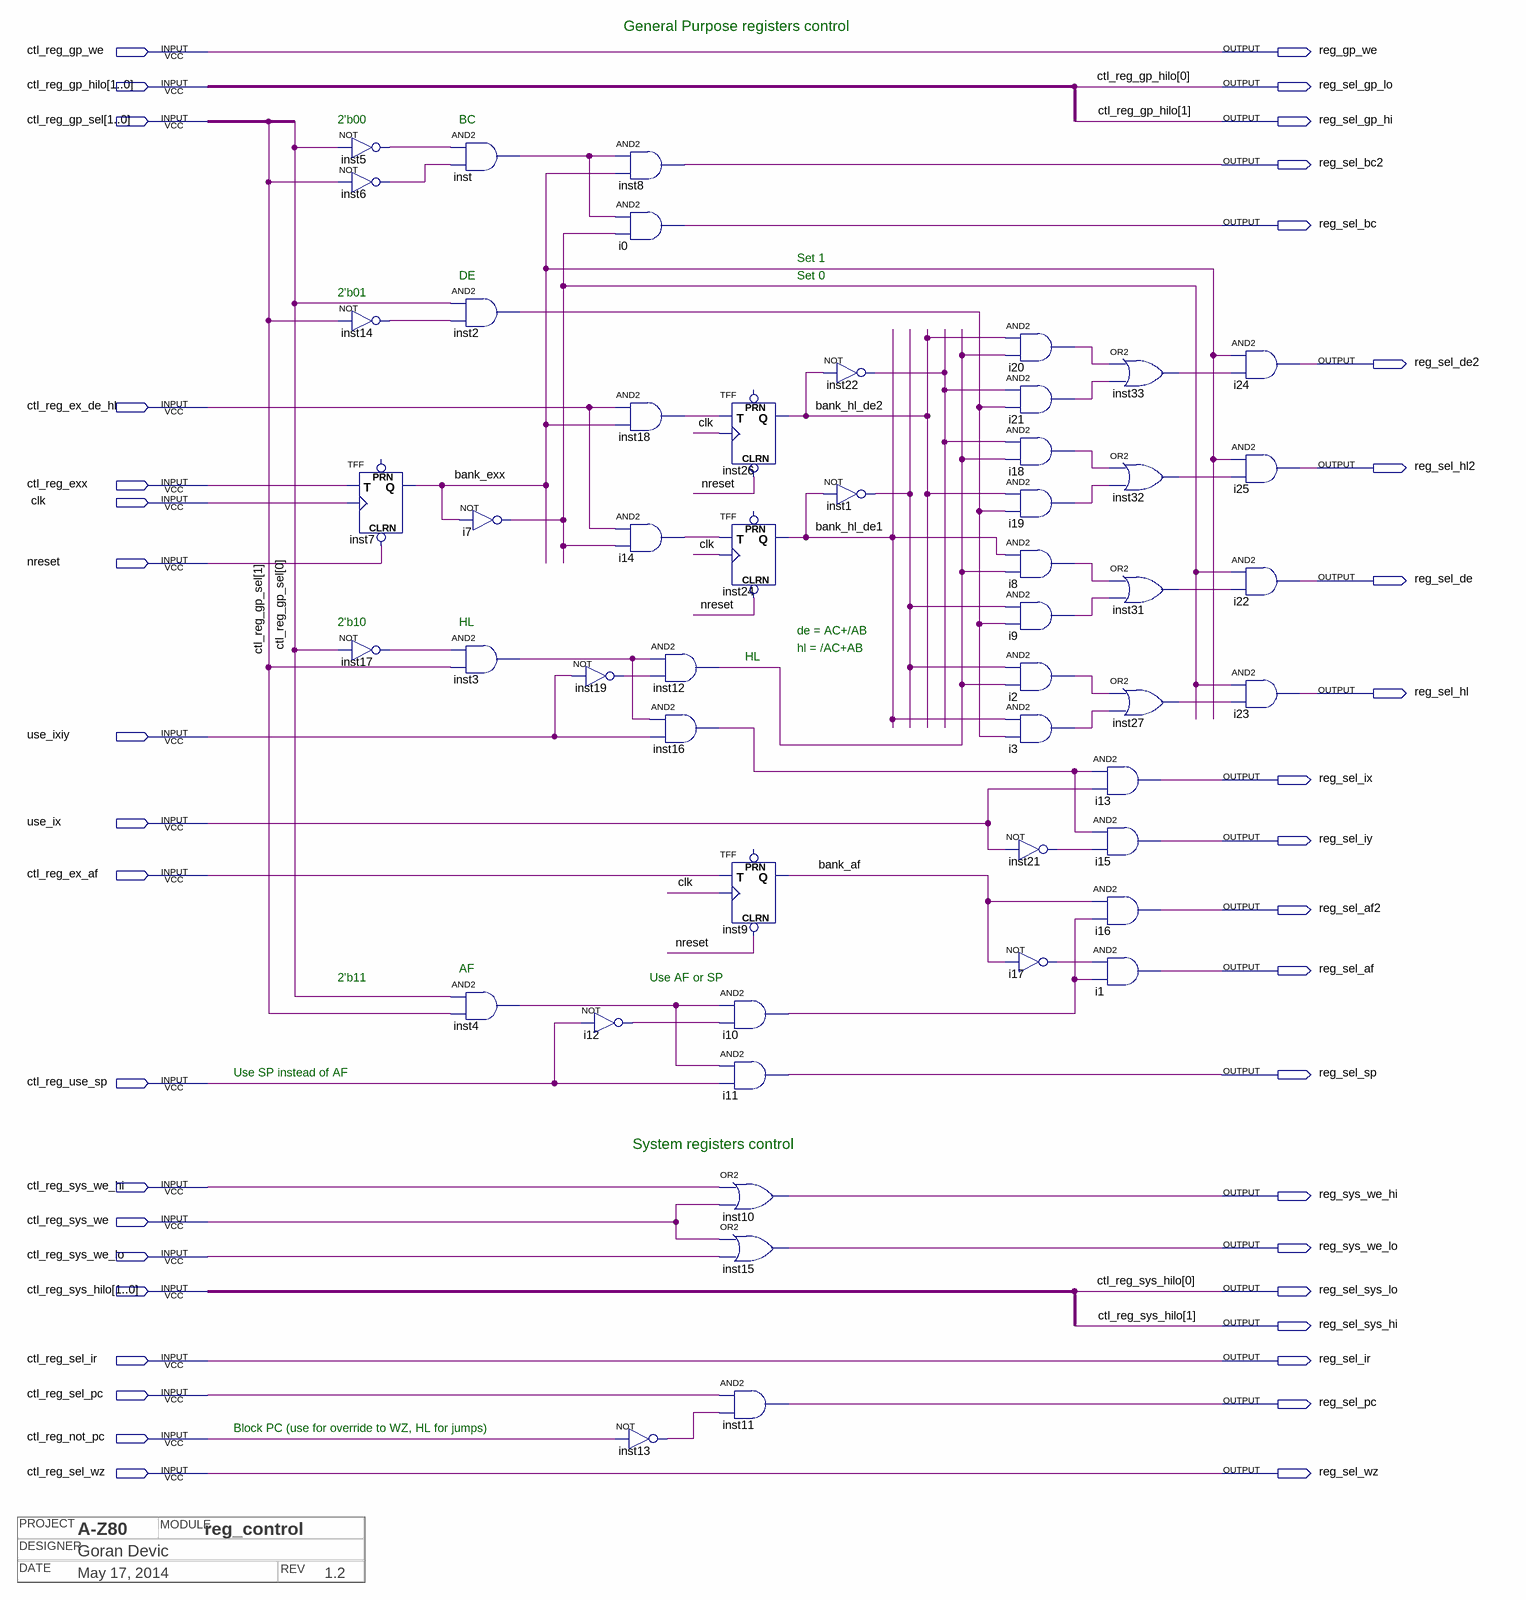
[diagram p0: schematic sheet]
// Quartus schematic reg_control.bdf as structural Verilog: 51 symbols, 40 pins
// Title block: PROJECT: A-Z80; MODULE: reg_control; DESIGNER: Goran Devic; DATE: May 17, 2014; REV: 1.2
module reg_control (
  input  ctl_reg_gp_we,
  input  [1:0] ctl_reg_gp_hilo,
  input  [1:0] ctl_reg_gp_sel,
  input  ctl_reg_ex_de_hl,
  input  ctl_reg_exx,
  input  clk,
  input  nreset,
  input  use_ixiy,
  input  use_ix,
  input  ctl_reg_ex_af,
  input  ctl_reg_use_sp,
  input  ctl_reg_sys_we_hi,
  input  ctl_reg_sys_we,
  input  ctl_reg_sys_we_lo,
  input  [1:0] ctl_reg_sys_hilo,
  input  ctl_reg_sel_ir,
  input  ctl_reg_sel_pc,
  input  ctl_reg_not_pc,
  input  ctl_reg_sel_wz,
  output reg_gp_we,
  output reg_sel_gp_lo,
  output reg_sel_gp_hi,
  output reg_sel_bc2,
  output reg_sel_bc,
  output reg_sel_de2,
  output reg_sel_hl2,
  output reg_sel_de,
  output reg_sel_hl,
  output reg_sel_ix,
  output reg_sel_iy,
  output reg_sel_af2,
  output reg_sel_af,
  output reg_sel_sp,
  output reg_sys_we_hi,
  output reg_sys_we_lo,
  output reg_sel_sys_lo,
  output reg_sel_sys_hi,
  output reg_sel_ir,
  output reg_sel_pc,
  output reg_sel_wz
);

  wire bank_af, bank_exx, bank_hl_de1, bank_hl_de2, i2_out, i3_out, i7_out, i8_out, i9_out, i10_out, i12_out,
       i14_out, i17_out, i18_out, i19_out, i20_out, i21_out, inst1_out, inst2_out, inst3_out, inst4_out,
       inst5_out, inst6_out, inst12_out, inst13_out, inst14_out, inst16_out, inst17_out, inst18_out,
       inst19_out, inst21_out, inst22_out, inst27_out, inst31_out, inst32_out, inst33_out, inst_out;

  not inst5 (inst5_out, ctl_reg_gp_sel[0]);
  not inst6 (inst6_out, ctl_reg_gp_sel[1]);
  not inst14 (inst14_out, ctl_reg_gp_sel[1]);
  TFF inst7 (.CLRN(nreset), .T(ctl_reg_exx), .CLK(clk), .Q(bank_exx));  // open: PRN
  not inst17 (inst17_out, ctl_reg_gp_sel[0]);
  and inst (inst_out, inst5_out, inst6_out);
  and inst2 (inst2_out, ctl_reg_gp_sel[0], inst14_out);
  not i7 (i7_out, bank_exx);
  and inst3 (inst3_out, inst17_out, ctl_reg_gp_sel[1]);
  and inst4 (inst4_out, ctl_reg_gp_sel[0], ctl_reg_gp_sel[1]);
  not inst19 (inst19_out, use_ixiy);
  not i12 (i12_out, ctl_reg_use_sp);
  and inst8 (reg_sel_bc2, inst_out, bank_exx);
  and i0 (reg_sel_bc, inst_out, i7_out);
  and inst18 (inst18_out, ctl_reg_ex_de_hl, bank_exx);
  and i14 (i14_out, ctl_reg_ex_de_hl, i7_out);
  and inst12 (inst12_out, inst3_out, inst19_out);
  and inst16 (inst16_out, inst3_out, use_ixiy);
  not inst13 (inst13_out, ctl_reg_not_pc);
  TFF inst26 (.CLRN(nreset), .T(inst18_out), .CLK(clk), .Q(bank_hl_de2));  // open: PRN
  TFF inst24 (.CLRN(nreset), .T(i14_out), .CLK(clk), .Q(bank_hl_de1));  // open: PRN
  TFF inst9 (.CLRN(nreset), .T(ctl_reg_ex_af), .CLK(clk), .Q(bank_af));  // open: PRN
  and i10 (i10_out, inst4_out, i12_out);
  and i11 (reg_sel_sp, inst4_out, ctl_reg_use_sp);
  or inst10 (reg_sys_we_hi, ctl_reg_sys_we_hi, ctl_reg_sys_we);
  or inst15 (reg_sys_we_lo, ctl_reg_sys_we, ctl_reg_sys_we_lo);
  and inst11 (reg_sel_pc, ctl_reg_sel_pc, inst13_out);
  not inst22 (inst22_out, bank_hl_de2);
  not inst1 (inst1_out, bank_hl_de1);
  and i20 (i20_out, bank_hl_de2, inst12_out);
  and i21 (i21_out, inst22_out, inst2_out);
  and i18 (i18_out, inst22_out, inst12_out);
  and i19 (i19_out, bank_hl_de2, inst2_out);
  and i8 (i8_out, bank_hl_de1, inst12_out);
  and i9 (i9_out, inst1_out, inst2_out);
  and i2 (i2_out, inst1_out, inst12_out);
  and i3 (i3_out, bank_hl_de1, inst2_out);
  not inst21 (inst21_out, use_ix);
  not i17 (i17_out, bank_af);
  or inst33 (inst33_out, i20_out, i21_out);
  or inst32 (inst32_out, i18_out, i19_out);
  or inst31 (inst31_out, i8_out, i9_out);
  or inst27 (inst27_out, i2_out, i3_out);
  and i13 (reg_sel_ix, inst16_out, use_ix);
  and i15 (reg_sel_iy, inst16_out, inst21_out);
  and i16 (reg_sel_af2, bank_af, i10_out);
  and i1 (reg_sel_af, i17_out, i10_out);
  and i24 (reg_sel_de2, bank_exx, inst33_out);
  and i25 (reg_sel_hl2, bank_exx, inst32_out);
  and i22 (reg_sel_de, i7_out, inst31_out);
  and i23 (reg_sel_hl, i7_out, inst27_out);

  assign reg_gp_we = ctl_reg_gp_we;
  assign reg_sel_gp_hi = ctl_reg_gp_hilo[1];
  assign reg_sel_gp_lo = ctl_reg_gp_hilo[0];
  assign reg_sel_ir = ctl_reg_sel_ir;
  assign reg_sel_sys_hi = ctl_reg_sys_hilo[1];
  assign reg_sel_sys_lo = ctl_reg_sys_hilo[0];
  assign reg_sel_wz = ctl_reg_sel_wz;

  // Notes on the sheet:
  //   General Purpose registers control
  //   2'b00
  //   BC
  //   Set 1
  //   DE
  //   Set 0
  //   2'b01
  //   2'b10
  //   HL
  //   de = AC+/AB
  //   hl = /AC+AB
  //   HL
  //   AF
  //   2'b11
  //   Use AF or SP
  //   Use SP instead of AF
  //   System registers control
  //   Block PC (use for override to WZ, HL for jumps)
endmodule
